# EAGLE design RFM12DipAdapter (EAGLE 6.5.0)
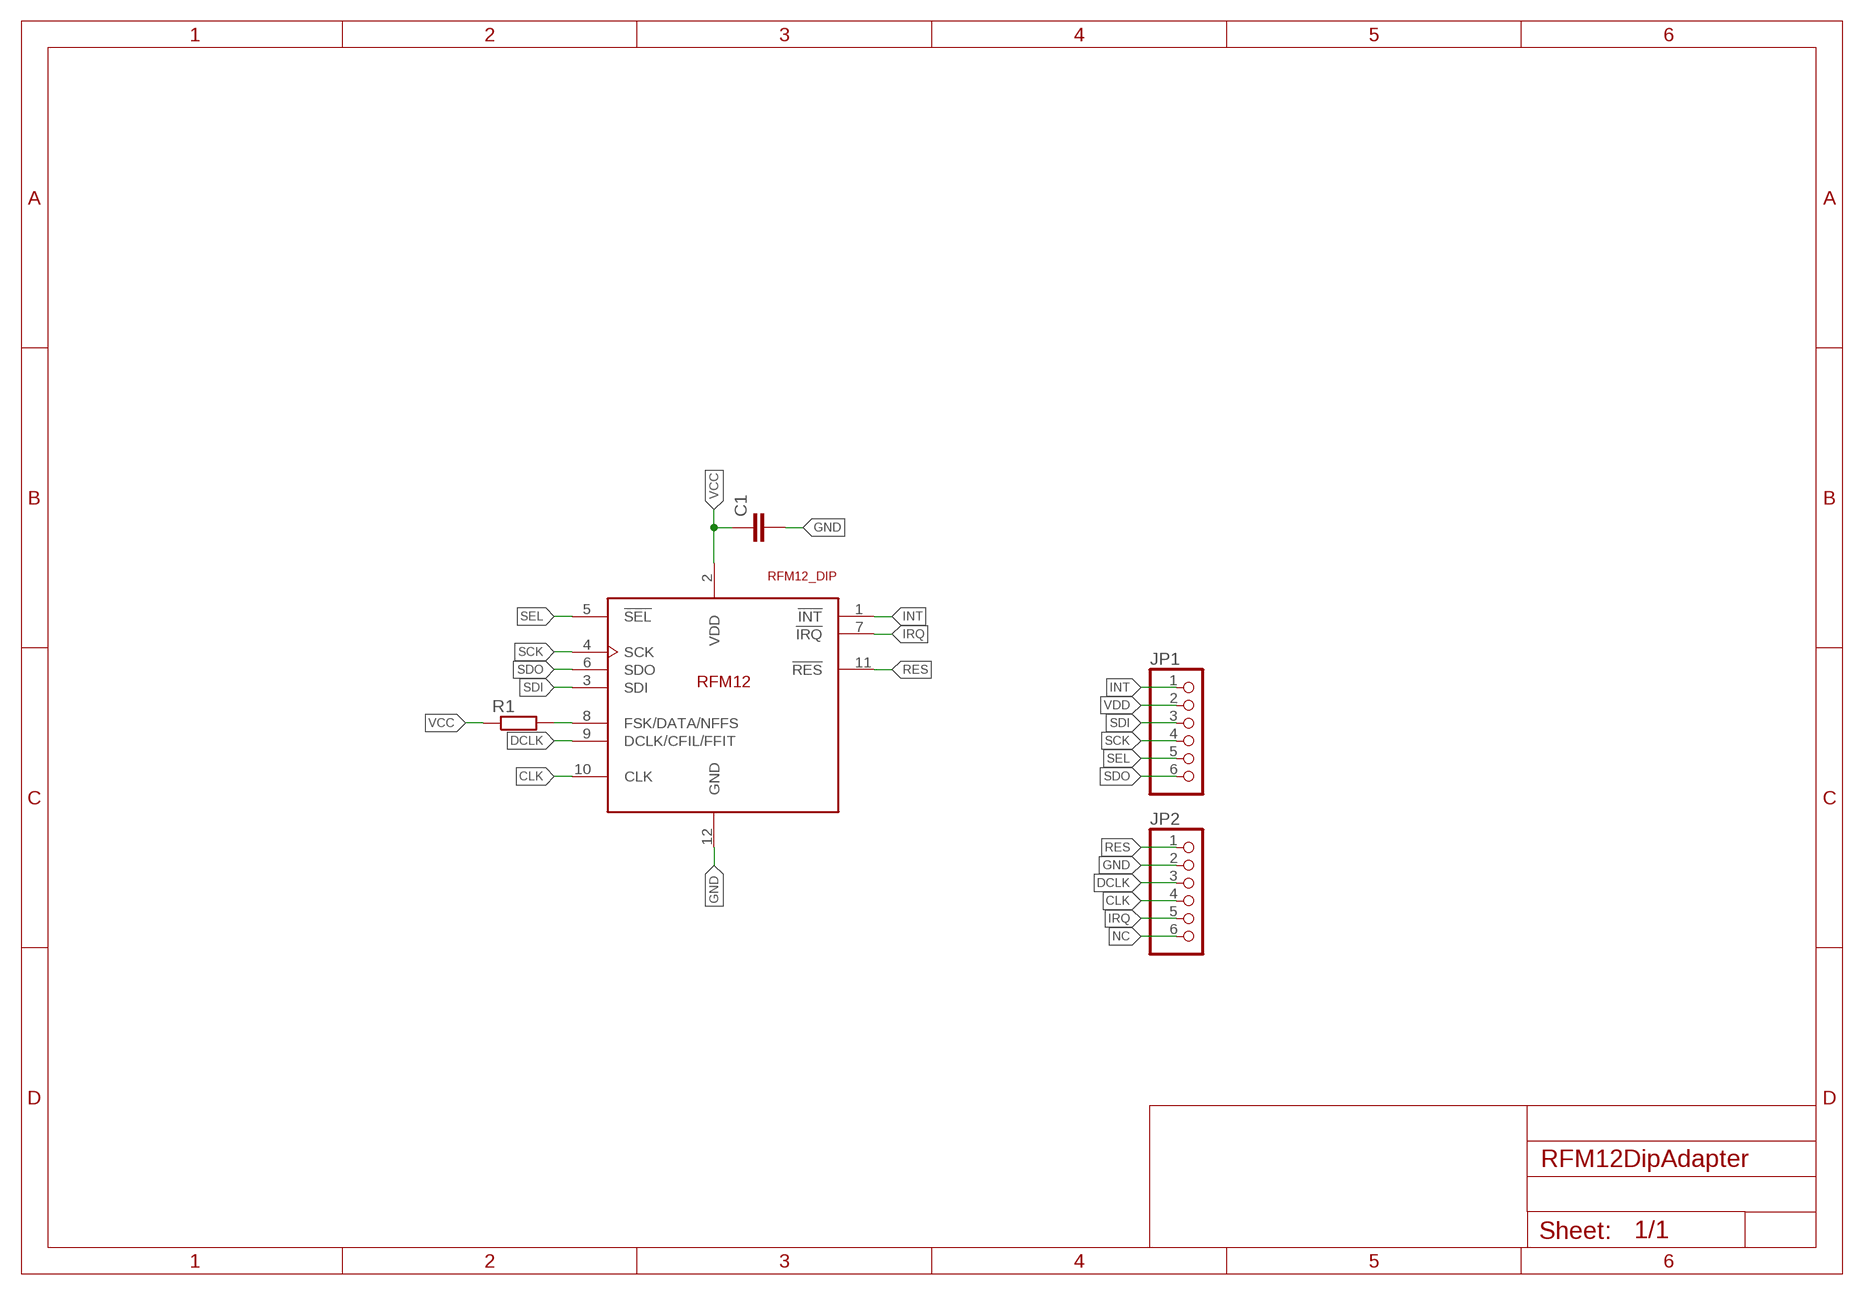
[diagram p0: schematic, sheet 1]

## Parts
C1  C-EUC0805  [C0805]
JP1  PINHD-1X6  [1X06]
JP2  PINHD-1X6  [1X06]
R1  R-EU_R1206  [R1206]
U$1  RFM12_DIP  [DIL-2MM-2X06]

## Nets
CLK: JP2.4 U$1.10(CLK)
DCLK: JP2.3 U$1.9(DCLK/CFIL/FFIT)
GND: C1.2 JP2.2 U$1.12(GND)
INT: JP1.1 U$1.1(!INT)
IRQ: JP2.5 U$1.7(!IRQ)
N$1: R1.2 U$1.8(FSK/DATA/NFFS)
NC: JP2.6
RES: JP2.1 U$1.11(!RES)
SCK: JP1.4 U$1.4(SCK)
SDI: JP1.3 U$1.3(SDI)
SDO: JP1.6 U$1.6(SDO)
SEL: JP1.5 U$1.5(!SEL)
VCC: C1.1 R1.1 U$1.2(VDD)
VDD: JP1.2

## Library data of the parts
C1 = rcl:C-EU: CAPACITOR, European symbol
JP1 JP2 = pinhead:PINHD-1X6: PIN HEADER
R1 = rcl:R-EU_: RESISTOR, European symbol
U$1 = rfm_12:RFM12_DIP: RFM12 is a low costing ISM band transceiver module implemented with unique PLL. It works signal ranges from 315/433/868/915MHZ bands, comply with FCC, ETSI regulation. The SPI interface is used to communicate with microcontroller for parameter setting.

## Board
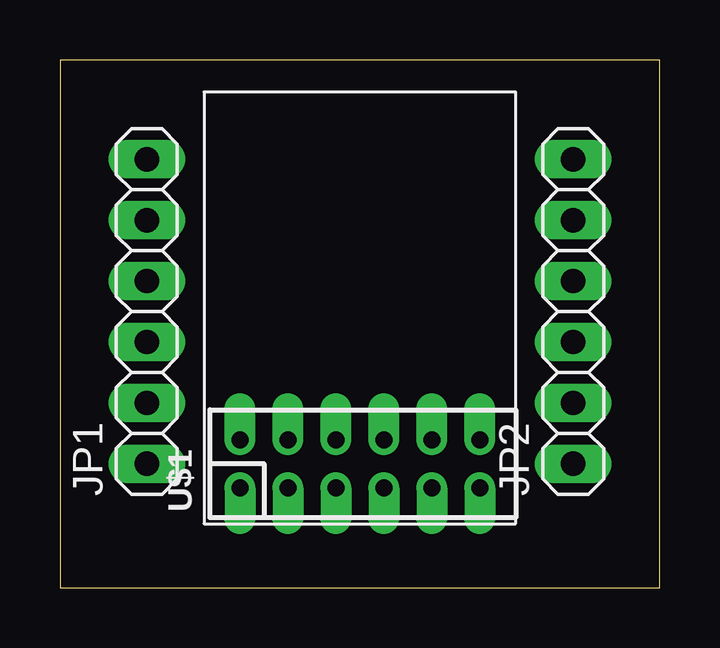
[diagram p1: board, top side]
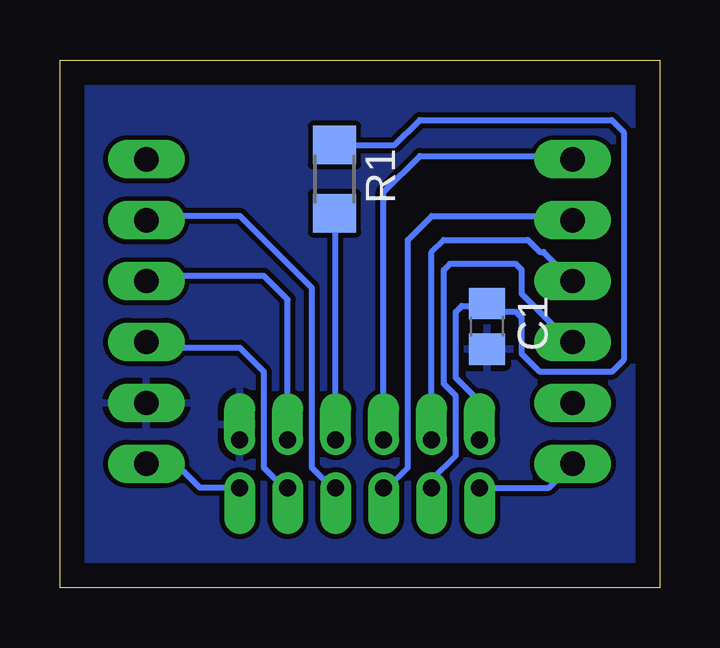
[diagram p2: board, bottom side, seen from below]

Size 25 x 22 mm. Coordinates in mm from the lower left corner, seen from the top.
Outline: 0,0 25,0 25,22 0,22 0,0
Copper layers (1*16): Top 0.035mm / dielectric 1.5mm / Bottom 0.035mm
Design rules "default *": minimum track width 10mil, minimum drill 24mil, track to track 8mil, track to pad 8mil, pad to pad 8mil, via to via 8mil, smd to smd 8mil, copper to edge 40mil, drill to drill 8mil, minimum pad ring 11.5mil, minimum via ring 8mil, stop-mask expansion 4mil, vias tented up to drill 0mil, thermal gap 10mil

### Footprints (pad centres in the part's own frame; a part is rotated, then mirrored left to right if it is on the bottom)
C0805 = smd 1.3 x 1.5: 1 -0.95,0; 2 0.95,0
1X06 = drill 1.016 long: 1 -6.35,0; 2 -3.81,0; 3 -1.27,0; 4 1.27,0; 5 3.81,0; 6 6.35,0
R1206 = smd 1.6 x 1.803: 1 -1.422,0; 2 1.422,0
DIL-2MM-2X06 = drill 0.711 offset: 1 -1,5; 2 1,5; 3 -1,3; 4 1,3; 5 -1,1; 6 1,1; 7 -1,-1; 8 1,-1; 9 -1,-3; 10 1,-3; 11 -1,-5; 12 1,-5

### Placement (x,y rotation side)
C1  7.2,10.89 270 bottom
JP1  3.62,11.51 90 top
JP2  21.4,11.51 90 top
R1  13.55,17.03 270 bottom
U$1  12.51,5.16 90 top

### Tracks (layer width: path | path; a pad name or v marks a point on that pad's centre or on a via)
CLK
  Bottom 0.254: U$1.10 15.51,12.01 16.5,13 21.18,13 JP2.4
DCLK
  Bottom 0.254: U$1.9 15.66,4.16 16.5,5 16.5,9 17.5,10 21.16,10 JP2.3
GND
  pour Bottom: -4,-4 34.1,-4 34.1,29.02 -4,29.02
INT
  Bottom 0.254: U$1.1 4.62,4.16 JP1.1
IRQ
  Bottom 0.254: U$1.7 13.66,4.16 14.5,5 14.5,12.5 17.5,15.5 21.22,15.5 JP2.5
N$1
  Bottom 0.254: U$1.8 13.51,15.56 R1.2
RES
  Bottom 0.254: U$1.11 19.16,4.16 20,5 21.24,5 JP2.1
SCK
  Bottom 0.254: U$1.4 9.51,13.99 9,14.5 5.5,14.5 5,14 4.84,14 JP1.4
SDI
  Bottom 0.254: U$1.3 9.51,4.49 8.5,5.5 8.5,8 9,8.5 9,13.25 8.75,13.5 6,13.5 5.75,13.25 5.75,12.25 4.5,11 4.5,10.5 3.88,10.5 JP1.3
SDO
  Bottom 0.254: U$1.6 11.51,16.49 10,18 3.76,18 JP1.6
SEL
  Bottom 0.254: U$1.5 11.34,4.16 10.5,5 10.5,14.5 9.5,15.5 3.8,15.5 JP1.5
VCC
  Bottom 0.254: R1.1 11.05,18.45 10,19.5 2,19.5 1.5,19 1.5,9.5 2,9 5,9 5.75,9.75 5.75,11.25 6,11.5 6.61,11.5 C1.1 7.29,11.75 8.25,11.75 8.5,11.5 8.5,8.75 7.51,7.76 U$1.2